# Altium schematic sheet Motor Driver and Encoder.SchDoc: Motor Driver and Encoder Counter
size 228 x 165 mm; DrawnBy: Joseph Riesen; DocumentNumber: 7; Revision: 1.0; SheetNumber: 7; SheetTotal: 10
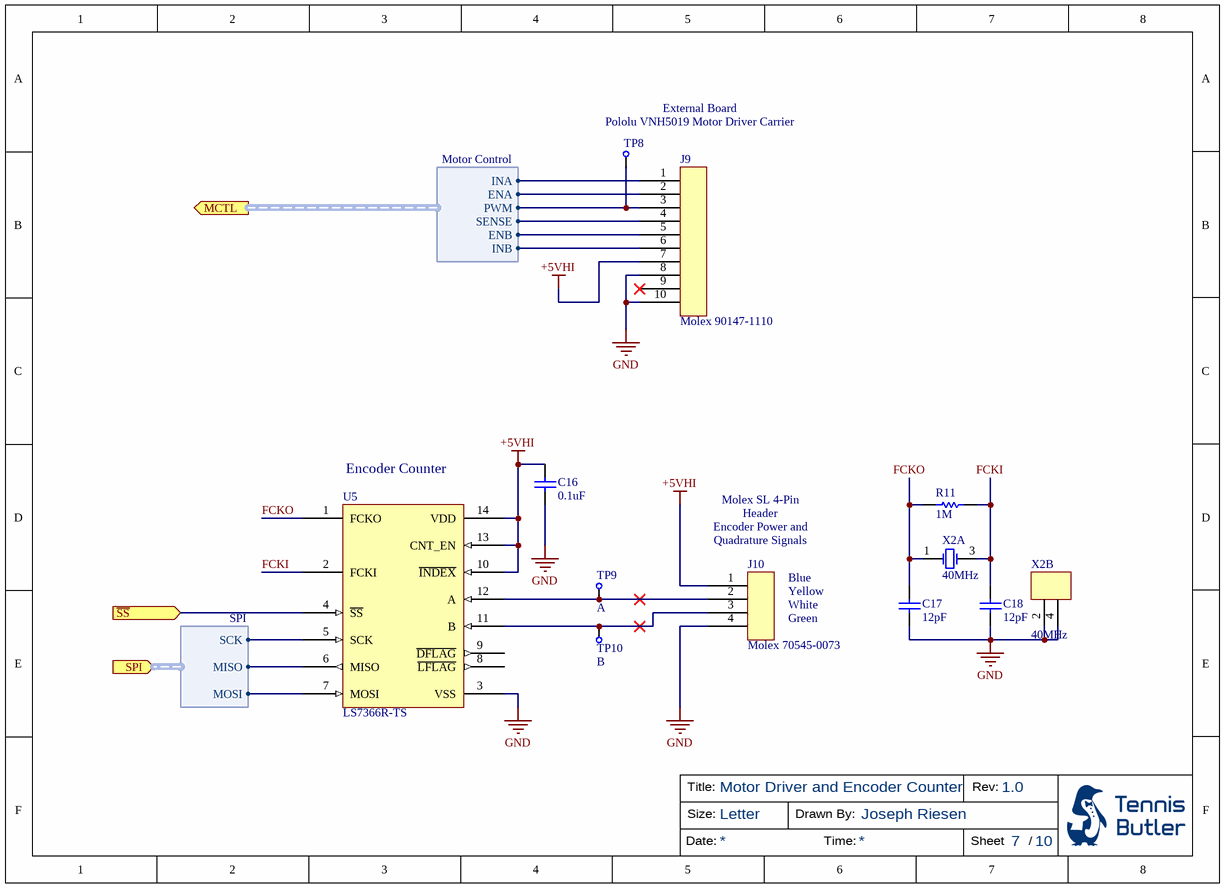
[diagram p0: Motor Driver and Encoder.SchDoc]

## Parts
C16  0.1uF  [CAPC0805(2012)100_M]
C17  12pF  [CAPC1608X87X35ML15T15]
C18  12pF  [CAPC1608X87X35ML15T15]
J9  Molex 90147-1110  [Molex 90147-1110]
J10  Molex 70545-0073  [Molex 70545-0073]
R11  1M  [RESC2013X70X40NL20T20]
TP8  PWM  [Test Point]  (value not drawn)  (no BOM)
TP9  A  [Test Point]  (no BOM)
TP10  B  [Test Point]  (no BOM)
U5  LS7366R-TS  [TSOP65P640X110-14M]
X2  40MHz  [DFN220P320X80-4M]  (parts A,B of 2)

## Ports
MCTL (out, harness Motor Control), SPI (in, harness SPI), ~{SS} (in)

## Harnesses
SPI: MISO, MOSI, SCK
Motor Control: ENA, ENB, INA, INB, PWM, SENSE

## Nets
+5VHI: C16.2 J9.7 J10.1 U5.10(~{INDEX}) U5.13(CNT_EN) U5.14(VDD)
GND: C16.1 C17.1 C18.1 J9.8 J9.10 J10.4 U5.3(VSS) X2.2(GND) X2.4(GND)
FCKI: C18.2 R11.1 U5.2(FCKI) X2.3(X2)
FCKO: C17.2 R11.2 U5.1(FCKO) X2.1(X1)
~{SS}: U5.4(~{SS}) ; port ~{SS}
NetJ9_1: J9.1 ; port MCTL.INA
NetJ9_2: J9.2 ; port MCTL.ENA
NetJ9_3: J9.3 TP8.1 ; port MCTL.PWM
NetJ9_4: J9.4 ; port MCTL.SENSE
NetJ9_5: J9.5 ; port MCTL.ENB
NetJ9_6: J9.6 ; port MCTL.INB
NetJ10_2: J10.2 TP9.1 U5.12(A)
NetJ10_3: J10.3 TP10.1 U5.11(B)
NetU5_5: U5.5(SCK) ; port SPI.SCK
NetU5_6: U5.6(MISO) ; port SPI.MISO
NetU5_7: U5.7(MOSI) ; port SPI.MOSI

Not connected (* = marked no-connect by the designer): J9 9*; U5 8(~{LFLAG}) 9(~{DFLAG})

## Notes on the sheet
- (near TP8) External Board
  Pololu VNH5019 Motor Driver Carrier
- (near U5) Encoder Counter
- (near J10) Molex SL 4-Pin Header
  Encoder Power and Quadrature Signals
- (near J10) Blue
- (near J10) Yellow
- (near J10) White
- (near J10) Green
- Title:
- Size:
- Letter
- Drawn By:
- Rev:
- Date:
- Time:
- Sheet
- /

## Library data of the parts
C16 = CMP-1036-04391-1: CAP 100nF 6.3V ±10% 0805 (2012 Metric) Thickness 1mm SMD; Case-EIA: 0805; Case-Metric: 2012; Tolerance: Â±10%; Rated Voltage: 6.3 V; Technology: SMT; Value: 100nF; Max Thickness: 1 mm
C17 C18 = CMP-2006-03475-1: Manufacturer: Kemet; Part Number: C0603C120C5GACTU
J9 = Molex 90147-1110 C-Grid 10-Pin Header: C-Grid® PC Board Connector, Single Row, Vertical, 10 Circuits, Tin (Sn) Plating; Number of Positions: 10; Current Rating: 3A; Voltage Rating: 350V; Pitch: 2.54mm; Glow Wire Compliant: Non-compliant; Supplier 1: Digikey; Manufacturer: Molex; Manufacturer Part Number: 90147-1110; Stock 1: 2940; Pricing 1: 1 = 2.53000, 10 = 2.29800, 25 = 2.15760, 50 = 2.06380, 100 = 1.97000, 250 = 1.78240, 500 = 1.64168, 1760 = 1.36024, 3520 = 1.31334 (USD); RoHS 1: Yes; Mount: Through Hole; Contact Plating: Tin; Contact Material: Bronze; Housing Material: Polyester; Material: Bronze; Min Operating Temperature: -55°C; Max Operating Temperature: 125°C; Number of Rows: 1; Packaging: Rail/Tube; Number of Contacts: 10; Termination: Solder; Orientation: Vertical; Package Quantity: 1760; Number of Circuits: 10; Radiation Hardening: No; Flammability Rating: UL94 V-0; ComponentLink1URL: https://datasheet.ciiva.com/16732/0901471110-pcb-receptacles-16732368.pdf?src-supplier=Avnet+Europe; ComponentLink1Description: Datasheet 1 (Avnet Europe); ComponentLink2URL: https://datasheet.ciiva.com/30193/276430901471110-pcb-receptacles-30193986.pdf?src-supplier=Onlinecomponents.com; ComponentLink2Description: Datasheet 3 (Mouser); ComponentLink3URL: https://datasheet.ciiva.com/5158/0901471110-pcb-receptacles-176767-5158986.pdf?src-supplier=Mouser; ComponentLink3Description: Datasheet 4 (Avnet); ComponentLink4URL: https://datasheet.ciiva.com/10082/0901471110-pcb-receptacles-10082332.pdf?src-supplier=Avnet; ComponentLink4Description: Datasheet 2 (Onlinecomponents.com); Supplier Part Number 1: WM3630-ND
J10 = Molex 70545-0073 SL 4-Pin Header: CONN HEADER VERT 4POS 2.54MM, PEG; Contact Resistance: 30mR; Number of Positions: 4; Current Rating: 3A; Voltage Rating: 250V; Insulation Resistance: 1GR; Glow Wire Compliant: Non-compliant; ComponentLink1Description: Drawing; ComponentLink1URL: https://www.molex.com/pdm_docs/sd/705450073_sd.pdf; Supplier 1: Digikey; Manufacturer: Molex; Manufacturer Part Number: 70545-0073; Stock 1: 705; Pricing 1: 1 = 1.55000, 10 = 1.41000, 100 = 1.20860, 500 = 1.00712, 1440 = 0.86325, 5760 = 0.76541, 10080 = 0.74815 (USD); RoHS 1: Yes; Mount: Through Hole; Contact Plating: Gold; Contact Material: Bronze; Housing Material: Polycyclohexylenedimethylene; Color: Black; Material: Brass; Min Operating Temperature: -40°C; Max Operating Temperature: 105°C; Number of Rows: 1; Packaging: Rail/Tube; Package Quantity: 1440; Termination: Through Hole; Orientation: Vertical; Number of Contacts: 4; Voltage Rating (DC): 250V; Number of Circuits: 4; Pitch: 2.54mm; Flammability Rating: UL94 V-0; ELV: Compliant; Supplier Part Number 1: WM12791-ND
R11 = CMP-1665-00012-4: Chip Resistor, 1000 KOhm, +/- 1%, 0.125 W, -55 to 155 degC, 0805 (2012 Metric), RoHS, Tape and Reel; Manufacturer: Panasonic; Voltage Rating: 150 V; ComponentLink2URL: http://industrial.panasonic.com/cdbs/www-data/pdf/RDA0000/AOA0000C86.pdf; PackageReference: 0805; Min Operating Temperature: -55 degC; RoHSCompliant: true; Package Quantity: 5000; ComponentLink1URL: http://www.panasonic.com/; Pins: 2; Height: 0.6 mm; Packaging: Tape and Reel; ComponentLink2Description: Datasheet; ComponentLink1Description: Manufacturer URL; Mounting Technology: Surface Mount; REACH SVHC: Yes; Mount: Surface Mount; PackageDescription: 2-Pin Surface Mount Device, Body 2 x 1.25 mm; DatasheetVersion: 04/2015; Max Operating Temperature: 155 degC; Length: 2 mm
TP8-TP10 = Test Point
U5 = LS7366R-TS: 32-Bit Quadrature Clock Counter with Serial Interface; Manufacturer: LSI/CSI; Case/Package: TSSOP; Manufacturer Part Number: LS7366R-TS; ComponentLink1Description: Datasheet; ComponentLink1URL: https://lsicsi.com/datasheets/LS7366R.pdf; Number of Pins: 14; Packaging: Tray; Supplier 1: LSI/CSI; Supplier Part Number 1: LS7366R-TS; Stock 1: 10000; Lead Free: Lead Free; RoHS: Yes; Pricing 1: 1 = 3.96000, 25 = 3.16000, 100 = 2.51000, 500 = 2.01000, 1000 = 1.61000, 5000 = 1.37000, 10000 = 1.17000 (USD); ComponentLink2Description: Manufacturer's Website; ComponentLink2URL: https://lsicsi.com/#/products/Incremental-Encoder-Interface/LS7366R_LS7366R-S_LS7366R-TS
X2 = 603-40-48: CRYSTAL 40MHZ 12PF SMD; Manufacturer: Fox Electronics; Supplier 1: Digi-Key; Manufacturer Part Number: 603-40-48; Stock 1: 3916; Pricing 1: 1 = 0.840000, 10 = 0.744000, 50 = 0.695400, 100 = 0.614500, 500 = 0.582120, 1000 = 0.485100 (USD); RoHS 1: No; ComponentLink1URL: https://www.foxonline.com/pdfs/603-40-48.pdf?src-supplier=Digi-Key; ComponentLink1Description: Datasheet; Supplier Part Number 1: 631-1480-1-ND